# Altium schematic sheet [04] EEPROM_FLASH.SchDoc
size A4
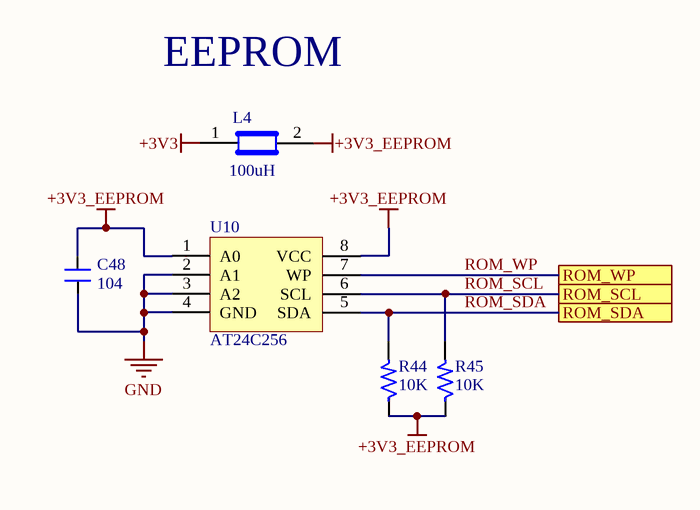
[diagram p0: [04] EEPROM_FLASH.SchDoc]

## Parts
C48  104  [C0603 SMT]
L4  100uH  [R0805]
R44  10K  [R0603 -SMT]
R45  10K  [R0603 -SMT]
U10  AT24C256  [SO-8]

## Ports
ROM_SCL, ROM_SDA, ROM_WP

## Nets
+3V3: L4.1
+3V3_EEPROM: C48.2 L4.2 R44.1 R45.1 U10.1(A0) U10.8(VCC)
GND: C48.1 U10.2(A1) U10.3(A2) U10.4(GND)
ROM_SCL: R45.2 U10.6(SCL) ; port ROM_SCL
ROM_SDA: R44.2 U10.5(SDA) ; port ROM_SDA
ROM_WP: U10.7(WP) ; port ROM_WP

## Notes on the sheet
- (near L4) EEPROM

## Library data of the parts
C48 = CM: Cap SMD; Value: 103
L4 = Ferrite Bead: 100uH 0805
R44 R45 = RM: Resistor SMD; Value: 1K
U10 = AT24Cxx